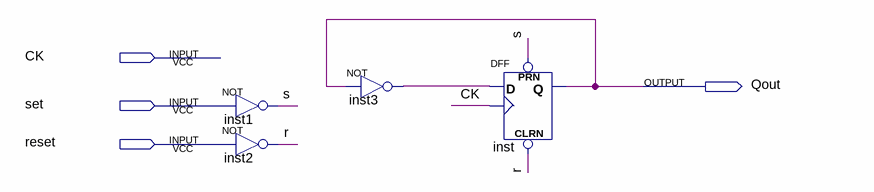
[diagram p0: schematic sheet]
// Quartus schematic DivFreq1.bdf as structural Verilog: 4 symbols, 4 pins
module DivFreq1 (
  input  CK,
  input  set,
  input  reset,
  output Qout
);

  wire inst3_out, r, s;

  not inst1 (s, set);
  not inst2 (r, reset);
  not inst3 (inst3_out, Qout);
  DFF inst (.CLRN(r), .CLK(CK), .D(inst3_out), .PRN(s), .Q(Qout));
endmodule
